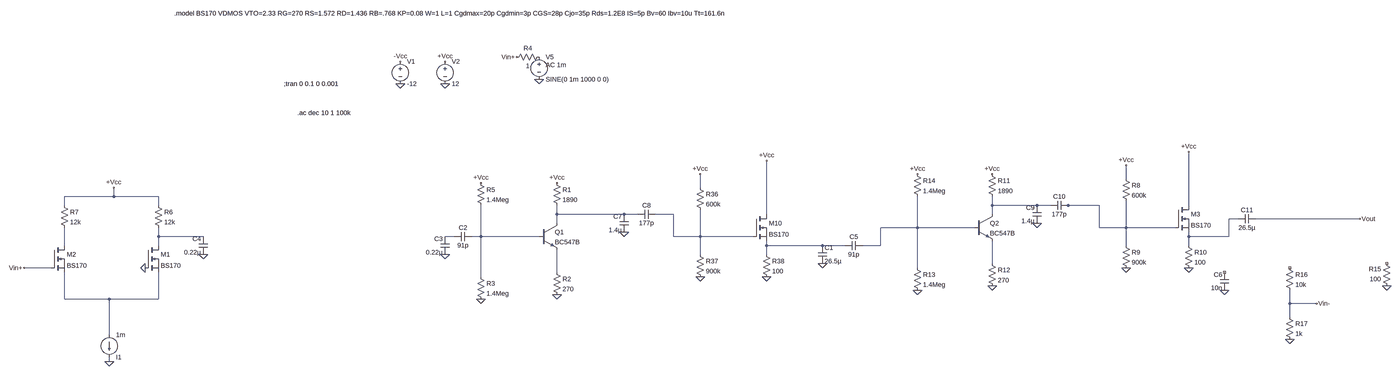
[diagram p0: schematic v4.asc, whole sheet]
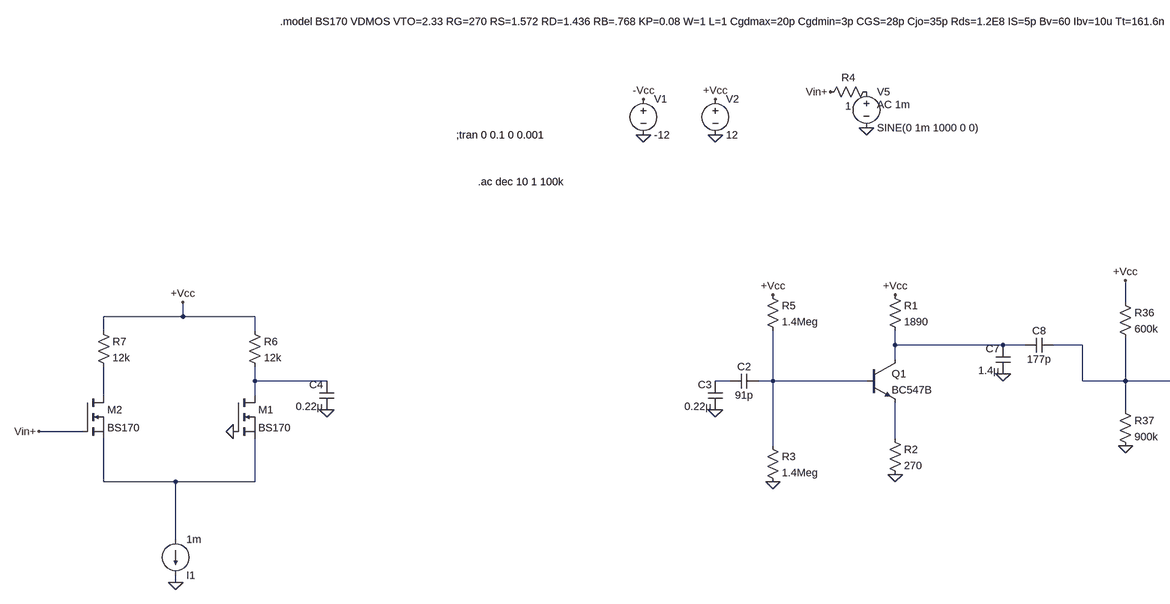
[diagram p1: schematic v4.asc, part, row 1 of 1, column 1 of 2]
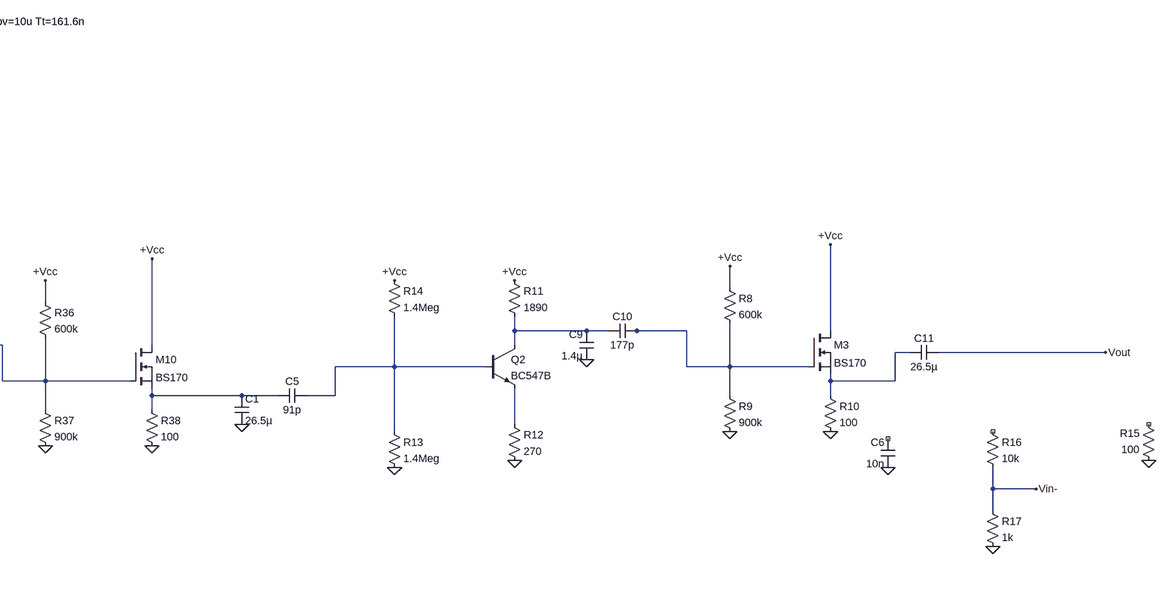
[diagram p2: schematic v4.asc, part, row 1 of 1, column 2 of 2]
v4.asc, the LTspice schematic file:
Version 4
SHEET 1 4084 732
WIRE 2128 -1392 2128 -1440
WIRE 256 -1360 256 -1408
WIRE -1840 -1328 -1840 -1360
WIRE -1840 -1328 -2016 -1328
WIRE -1680 -1328 -1840 -1328
WIRE -2016 -1296 -2016 -1328
WIRE -1680 -1296 -1680 -1328
WIRE 1616 -1296 1616 -1328
WIRE 1776 -1296 1616 -1296
WIRE 1824 -1296 1776 -1296
WIRE 1888 -1296 1872 -1296
WIRE 2032 -1296 1888 -1296
WIRE 2400 -1296 2400 -1488
WIRE -256 -1264 -256 -1296
WIRE -16 -1264 -256 -1264
WIRE 32 -1264 -16 -1264
WIRE 160 -1264 96 -1264
WIRE 528 -1264 528 -1456
WIRE 1616 -1264 1616 -1296
WIRE 2576 -1248 2544 -1248
WIRE 3120 -1248 2640 -1248
WIRE -256 -1232 -256 -1264
WIRE 1344 -1216 1344 -1328
WIRE 1344 -1216 1024 -1216
WIRE 1552 -1216 1344 -1216
WIRE 2032 -1216 2032 -1296
WIRE 2128 -1216 2128 -1312
WIRE 2128 -1216 2032 -1216
WIRE 2352 -1216 2128 -1216
WIRE -1680 -1184 -1680 -1216
WIRE -1520 -1184 -1680 -1184
WIRE -624 -1184 -656 -1184
WIRE -528 -1184 -528 -1296
WIRE -528 -1184 -560 -1184
WIRE -320 -1184 -528 -1184
WIRE 160 -1184 160 -1264
WIRE 256 -1184 256 -1280
WIRE 256 -1184 160 -1184
WIRE 480 -1184 256 -1184
WIRE 2400 -1184 2400 -1200
WIRE 2544 -1184 2544 -1248
WIRE 2544 -1184 2400 -1184
WIRE -2016 -1152 -2016 -1216
WIRE -1680 -1152 -1680 -1184
WIRE 528 -1152 528 -1168
WIRE 816 -1152 528 -1152
WIRE 896 -1152 816 -1152
WIRE 1024 -1152 1024 -1216
WIRE 1024 -1152 960 -1152
WIRE 2128 -1152 2128 -1216
WIRE 2400 -1152 2400 -1184
WIRE 256 -1120 256 -1184
WIRE 528 -1120 528 -1152
WIRE 1616 -1088 1616 -1168
WIRE -2064 -1072 -2160 -1072
WIRE 1344 -1072 1344 -1216
WIRE -256 -1056 -256 -1136
WIRE -528 -1040 -528 -1184
WIRE -2016 -960 -2016 -1056
WIRE -1856 -960 -2016 -960
WIRE -1680 -960 -1680 -1056
WIRE -1680 -960 -1856 -960
WIRE 2816 -944 2816 -992
WIRE 2912 -944 2816 -944
WIRE 2816 -896 2816 -944
WIRE -1856 -832 -1856 -960
WIRE -1856 -736 -1856 -752
FLAG -816 -1760 0
FLAG -656 -1760 0
FLAG -816 -1840 -Vcc
FLAG -656 -1840 +Vcc
FLAG -320 -1776 0
FLAG -400 -1856 Vin+
FLAG 256 -1408 +Vcc
FLAG 528 -1456 +Vcc
FLAG -256 -976 0
FLAG -528 -960 0
FLAG -528 -1376 +Vcc
FLAG -256 -1376 +Vcc
FLAG 528 -1040 0
FLAG 256 -1040 0
FLAG -1840 -1360 +Vcc
FLAG -1856 -736 0
FLAG 2128 -1440 +Vcc
FLAG 2400 -1488 +Vcc
FLAG 1616 -1008 0
FLAG 1344 -992 0
FLAG 1344 -1408 +Vcc
FLAG 1616 -1408 +Vcc
FLAG 2400 -1072 0
FLAG 2128 -1072 0
FLAG 3216 -1008 0
FLAG 2528 -992 0
FLAG 2816 -816 0
FLAG -2160 -1072 Vin+
FLAG 2912 -944 Vin-
FLAG 3120 -1248 Vout
FLAG -656 -1120 0
FLAG -1728 -1072 0
FLAG -16 -1200 0
FLAG 816 -1088 0
FLAG 1776 -1232 0
FLAG -1520 -1120 0
SYMBOL voltage -816 -1856 R0
WINDOW 123 0 0 Left 0
WINDOW 39 0 0 Left 0
SYMATTR InstName V1
SYMATTR Value -12
SYMBOL voltage -656 -1856 R0
WINDOW 123 0 0 Left 0
WINDOW 39 0 0 Left 0
SYMATTR InstName V2
SYMATTR Value 12
SYMBOL voltage -320 -1872 R0
WINDOW 123 24 44 Left 2
WINDOW 39 0 0 Left 0
SYMATTR Value2 AC 1m
SYMATTR InstName V5
SYMATTR Value SINE(0 1m 1000 0 0)
SYMBOL res -304 -1872 R90
WINDOW 0 0 56 VBottom 2
WINDOW 3 32 56 VTop 2
SYMATTR InstName R4
SYMATTR Value 1
SYMBOL nmos 480 -1264 R0
SYMATTR InstName M10
SYMATTR Value BS170
SYMBOL res 240 -1376 R0
SYMATTR InstName R36
SYMATTR Value 600k
SYMBOL res 240 -1136 R0
SYMATTR InstName R37
SYMATTR Value 900k
SYMBOL res 512 -1136 R0
SYMATTR InstName R38
SYMATTR Value 100
SYMBOL npn -320 -1232 R0
SYMATTR InstName Q1
SYMATTR Value BC547B
SYMBOL res -272 -1392 R0
SYMATTR InstName R1
SYMATTR Value 1890
SYMBOL res -272 -1072 R0
SYMATTR InstName R2
SYMATTR Value 270
SYMBOL res -544 -1056 R0
SYMATTR InstName R3
SYMATTR Value 1.4Meg
SYMBOL res -544 -1392 R0
SYMATTR InstName R5
SYMATTR Value 1.4Meg
SYMBOL nmos -2064 -1152 R0
SYMATTR InstName M2
SYMATTR Value BS170
SYMBOL res -1696 -1312 R0
SYMATTR InstName R6
SYMATTR Value 12k
SYMBOL res -2032 -1312 R0
SYMATTR InstName R7
SYMATTR Value 12k
SYMBOL current -1856 -832 R0
WINDOW 0 24 80 Left 2
WINDOW 3 24 0 Left 2
WINDOW 123 0 0 Left 0
WINDOW 39 0 0 Left 0
SYMATTR InstName I1
SYMATTR Value 1m
SYMBOL nmos -1728 -1152 R0
SYMATTR InstName M1
SYMATTR Value BS170
SYMBOL cap -560 -1200 R90
WINDOW 0 0 32 VBottom 2
WINDOW 3 32 32 VTop 2
SYMATTR InstName C2
SYMATTR Value 91p
SYMBOL nmos 2352 -1296 R0
SYMATTR InstName M3
SYMATTR Value BS170
SYMBOL res 2112 -1408 R0
SYMATTR InstName R8
SYMATTR Value 600k
SYMBOL res 2112 -1168 R0
SYMATTR InstName R9
SYMATTR Value 900k
SYMBOL res 2384 -1168 R0
SYMATTR InstName R10
SYMATTR Value 100
SYMBOL npn 1552 -1264 R0
SYMATTR InstName Q2
SYMATTR Value BC547B
SYMBOL res 1600 -1424 R0
SYMATTR InstName R11
SYMATTR Value 1890
SYMBOL res 1600 -1104 R0
SYMATTR InstName R12
SYMATTR Value 270
SYMBOL res 1328 -1088 R0
SYMATTR InstName R13
SYMATTR Value 1.4Meg
SYMBOL res 1328 -1424 R0
SYMATTR InstName R14
SYMATTR Value 1.4Meg
SYMBOL res 3232 -992 R180
WINDOW 0 36 76 Left 2
WINDOW 3 36 40 Left 2
SYMATTR InstName R15
SYMATTR Value 100
SYMBOL cap 2544 -992 R180
WINDOW 0 24 56 Left 2
WINDOW 3 24 8 Left 2
SYMATTR InstName C6
SYMATTR Value 10n
SYMBOL res 2800 -1088 R0
SYMATTR InstName R16
SYMATTR Value 10k
SYMBOL res 2800 -912 R0
SYMATTR InstName R17
SYMATTR Value 1k
SYMBOL cap -640 -1120 R180
WINDOW 0 24 56 Left 2
WINDOW 3 24 8 Left 2
SYMATTR InstName C3
SYMATTR Value 0.22µ
SYMBOL cap 0 -1200 R180
WINDOW 0 24 56 Left 2
WINDOW 3 24 8 Left 2
SYMATTR InstName C7
SYMATTR Value 1.4µ
SYMBOL cap 32 -1248 R270
WINDOW 0 32 32 VTop 2
WINDOW 3 0 32 VBottom 2
SYMATTR InstName C8
SYMATTR Value 177p
SYMBOL cap 896 -1136 R270
WINDOW 0 32 32 VTop 2
WINDOW 3 0 32 VBottom 2
SYMATTR InstName C5
SYMATTR Value 91p
SYMBOL cap 800 -1152 R0
SYMATTR InstName C1
SYMATTR Value 26.5µ
SYMBOL cap 1792 -1232 R180
WINDOW 0 24 56 Left 2
WINDOW 3 24 8 Left 2
SYMATTR InstName C9
SYMATTR Value 1.4µ
SYMBOL cap 1824 -1280 R270
WINDOW 0 32 32 VTop 2
WINDOW 3 0 32 VBottom 2
SYMATTR InstName C10
SYMATTR Value 177p
SYMBOL cap 2576 -1232 R270
WINDOW 0 32 32 VTop 2
WINDOW 3 0 32 VBottom 2
SYMATTR InstName C11
SYMATTR Value 26.5µ
SYMBOL cap -1504 -1120 R180
WINDOW 0 24 56 Left 2
WINDOW 3 24 8 Left 2
SYMATTR InstName C4
SYMATTR Value 0.22µ
TEXT -1232 -1760 Left 2 !;tran 0 0.1 0 0.001
TEXT -1624 -2048 Left 2 !.model BS170 VDMOS VTO=2.33 RG=270 RS=1.572 RD=1.436 RB=.768 KP=0.08 W=1 L=1 Cgdmax=20p Cgdmin=3p CGS=28p Cjo=35p Rds=1.2E8 IS=5p Bv=60 Ibv=10u Tt=161.6n
TEXT -1184 -1656 Left 2 !.ac dec 10 1 100k

The netlist it stands for:
* v4.asc
V1 -Vcc 0 -12
V2 +Vcc 0 12
V5 P001 0 SINE(0 1m 1000 0 0) AC 1m
R4 P001 Vin+ 1
M10 +Vcc N004 N011 N011 BS170
R36 +Vcc N004 600k
R37 N004 0 900k
R38 N011 0 100
Q1 N003 N009 N013 0 BC547B
R1 +Vcc N003 1890
R2 N013 0 270
R3 N009 0 1.4Meg
R5 +Vcc N009 1.4Meg
M2 N010 Vin+ N014 N014 BS170
R6 +Vcc N007 12k
R7 +Vcc N010 12k
I1 N014 0 1m
M1 N007 0 N014 N014 BS170
C2 N009 N008 91p
M3 +Vcc N002 N005 N005 BS170
R8 +Vcc N002 600k
R9 N002 0 900k
R10 N005 0 100
Q2 N001 N006 N012 0 BC547B
R11 +Vcc N001 1890
R12 N012 0 270
R13 N006 0 1.4Meg
R14 +Vcc N006 1.4Meg
R15 0 NC_01 100
C6 0 NC_02 10n
R16 NC_03 Vin- 10k
R17 Vin- 0 1k
C3 0 N008 0.22µ
C7 0 N003 1.4µ
C8 N003 N004 177p
C5 N011 N006 91p
C1 N011 0 26.5µ
C9 0 N001 1.4µ
C10 N001 N002 177p
C11 N005 Vout 26.5µ
C4 0 N007 0.22µ
.model NPN NPN
.model PNP PNP
.lib standard.bjt
.model NMOS NMOS
.model PMOS PMOS
.lib standard.mos
;tran 0 0.1 0 0.001
.model BS170 VDMOS VTO=2.33 RG=270 RS=1.572 RD=1.436 RB=.768 KP=0.08 W=1 L=1 Cgdmax=20p Cgdmin=3p CGS=28p Cjo=35p Rds=1.2E8 IS=5p Bv=60 Ibv=10u Tt=161.6n
.ac dec 10 1 100k
.backanno
.end